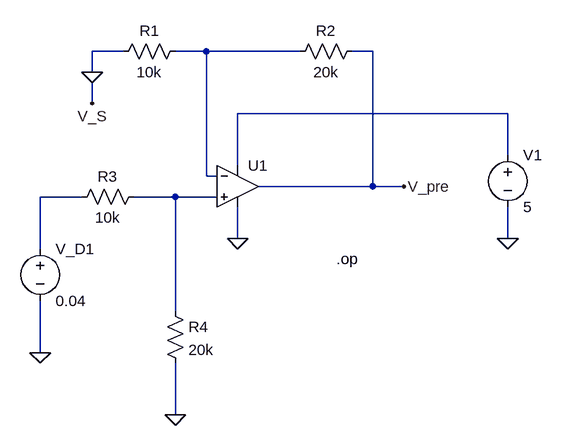
[diagram p0: schematic u1_vds_sensing(offset -1mV).asc]
u1_vds_sensing(offset -1mV).asc, the LTspice schematic file:
Version 4
SHEET 1 880 680
WIRE -112 -48 -160 -48
WIRE 16 -48 -32 -48
WIRE 160 -48 16 -48
WIRE 272 -48 240 -48
WIRE -160 -16 -160 -48
WIRE -160 32 -160 0
WIRE 480 48 64 48
WIRE 480 112 480 48
WIRE 64 128 64 48
WIRE 16 144 16 -48
WIRE 32 144 16 144
WIRE 272 160 272 -48
WIRE 272 160 96 160
WIRE 320 160 272 160
WIRE -176 176 -240 176
WIRE -32 176 -96 176
WIRE 32 176 -32 176
WIRE 64 240 64 192
WIRE 480 240 480 192
WIRE -240 256 -240 176
WIRE -32 352 -32 176
WIRE -240 416 -240 336
WIRE -32 512 -32 432
FLAG -240 416 0
FLAG -32 512 0
FLAG 64 240 0
FLAG -160 -16 0
FLAG -160 32 V_S
FLAG 320 160 V_pre
FLAG 480 240 0
SYMBOL OpAmps\\UniversalOpAmp2 64 160 R0
SYMATTR InstName U1
SYMATTR SpiceLine Ilimit=25m Rail=0 Vos=-1m
SYMBOL res -16 -64 R90
WINDOW 0 0 56 VBottom 2
WINDOW 3 32 56 VTop 2
SYMATTR InstName R1
SYMATTR Value 10k
SYMBOL res 256 -64 R90
WINDOW 0 0 56 VBottom 2
WINDOW 3 32 56 VTop 2
SYMATTR InstName R2
SYMATTR Value 20k
SYMBOL res -192 192 R270
WINDOW 0 32 56 VTop 2
WINDOW 3 0 56 VBottom 2
SYMATTR InstName R3
SYMATTR Value 10k
SYMBOL res -48 336 R0
SYMATTR InstName R4
SYMATTR Value 20k
SYMBOL voltage -240 240 R0
WINDOW 123 0 0 Left 0
WINDOW 39 0 0 Left 0
SYMATTR InstName V_D1
SYMATTR Value 0.04
SYMBOL voltage 480 96 R0
WINDOW 123 0 0 Left 0
WINDOW 39 0 0 Left 0
SYMATTR InstName V1
SYMATTR Value 5
TEXT 216 272 Left 2 !.op

The netlist it stands for:
* u1_vds_sensing(offset -1mV).asc
XU1 N004 N001 N002 0 V_pre level2 Avol=1Meg GBW=10Meg Slew=10Meg Ilimit=25m Rail=0 Vos=-1m En=0 Enk=0 In=0 Ink=0 Rin=500Meg  ; pins In+ In- V+ V- OUT
R1 N001 0 10k
R2 V_pre N001 20k
R3 N003 N004 10k
R4 N004 0 20k
V_D1 N003 0 0.04
V1 N002 0 5
.op
.lib UniversalOpAmp2.lib
.backanno
.end